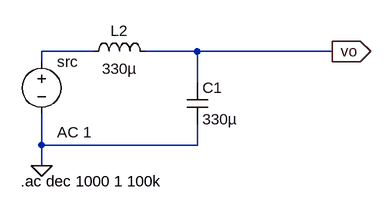
[diagram p0: schematic bode.asc]
bode.asc, the LTspice schematic file:
Version 4
SHEET 1 880 680
WIRE 112 112 32 112
WIRE 272 112 192 112
WIRE 480 112 272 112
WIRE 32 128 32 112
WIRE 272 160 272 112
WIRE 32 256 32 208
WIRE 272 256 272 224
WIRE 272 256 32 256
WIRE 32 288 32 256
FLAG 32 288 0
FLAG 480 112 vo
IOPIN 480 112 Out
SYMBOL cap 256 160 R0
SYMATTR InstName C1
SYMATTR Value 330µ
SYMBOL voltage 32 112 R0
WINDOW 123 24 124 Left 2
WINDOW 39 0 0 Left 0
SYMATTR Value2 AC 1
SYMATTR InstName src
SYMATTR Value ""
SYMBOL ind 96 128 R270
WINDOW 0 32 56 VTop 2
WINDOW 3 5 56 VBottom 2
SYMATTR InstName L2
SYMATTR Value 330µ
TEXT 0 312 Left 2 !.ac dec 1000 1 100k

The netlist it stands for:
* bode.asc
C1 vo 0 330µ
V§src N001 0 AC 1
L2 N001 vo 330µ
.ac dec 1000 1 100k
.backanno
.end

* Results of the author's LTspice run, read from the files saved beside the schematic
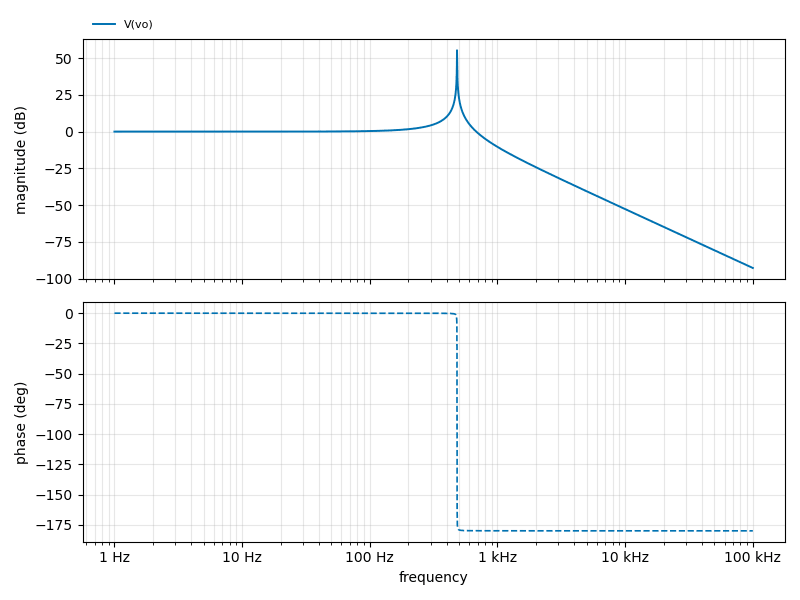
[diagram p1: AC Analysis of bode.asc, plotted from the saved traces]
* AC Analysis, 1 run:
*   V(vo): 0.00 dB at 1 Hz, -92.67 dB at 100 kHz, peak 55.25 dB at 481.9 Hz, 3 dB below the peak at 481.6 Hz and 482.5 Hz